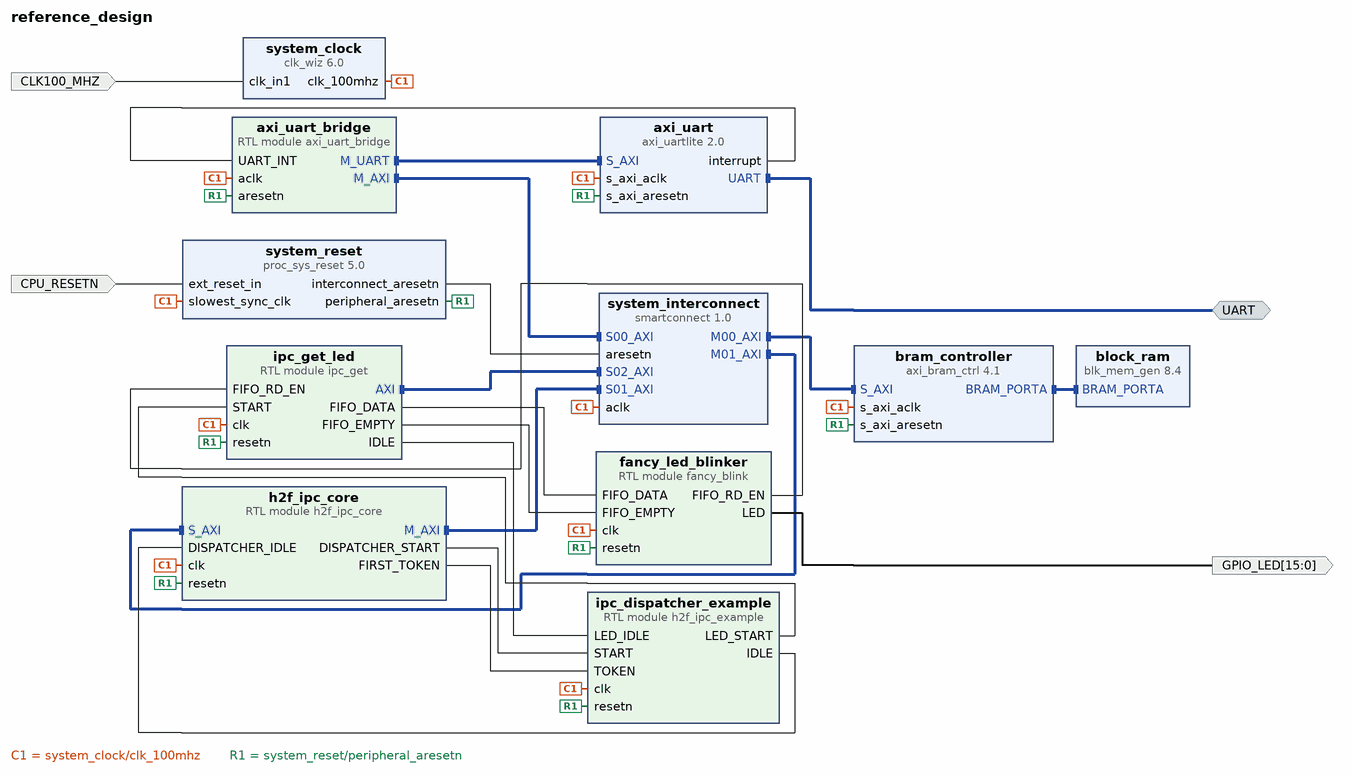
[diagram p0: block diagram of the top level]
# Vivado block design reference_design, xc7a100tcsg324-1, Vivado 2021.1
create_bd_design reference_design

create_bd_intf_port -mode Master -vlnv xilinx.com:interface:uart_rtl:1.0 UART
create_bd_port -dir I -type clk CLK100_MHZ
set_property -dict {CONFIG.ASSOCIATED_RESET CPU_RESETN} [get_bd_ports CLK100_MHZ]
create_bd_port -dir I -type rst CPU_RESETN
create_bd_port -dir O -from 15 -to 0 GPIO_LED

create_bd_cell -type ip -vlnv xilinx.com:ip:clk_wiz:6.0 system_clock
set_property -dict [list \
  CONFIG.CLKOUT1_DRIVES BUFGCE \
  CONFIG.CLKOUT2_DRIVES BUFGCE \
  CONFIG.CLKOUT3_DRIVES BUFGCE \
  CONFIG.CLKOUT4_DRIVES BUFGCE \
  CONFIG.CLKOUT5_DRIVES BUFGCE \
  CONFIG.CLKOUT6_DRIVES BUFGCE \
  CONFIG.CLKOUT7_DRIVES BUFGCE \
  CONFIG.CLK_OUT1_PORT clk_100mhz \
  CONFIG.FEEDBACK_SOURCE FDBK_AUTO \
  CONFIG.USE_LOCKED false \
  CONFIG.USE_RESET false \
  CONFIG.USE_SAFE_CLOCK_STARTUP true \
] [get_bd_cells system_clock]
create_bd_cell -type ip -vlnv xilinx.com:ip:proc_sys_reset:5.0 system_reset
create_bd_cell -type ip -vlnv xilinx.com:ip:smartconnect:1.0 system_interconnect
set_property -dict {CONFIG.NUM_MI 2 CONFIG.NUM_SI 3} [get_bd_cells system_interconnect]
create_bd_cell -type ip -vlnv xilinx.com:ip:axi_bram_ctrl:4.1 bram_controller
set_property -dict {CONFIG.DATA_WIDTH 256 CONFIG.SINGLE_PORT_BRAM 1} [get_bd_cells bram_controller]
create_bd_cell -type ip -vlnv xilinx.com:ip:blk_mem_gen:8.4 block_ram
set_property -dict {CONFIG.EN_SAFETY_CKT false} [get_bd_cells block_ram]
create_bd_cell -type module -reference axi_uart_bridge axi_uart_bridge
create_bd_cell -type ip -vlnv xilinx.com:ip:axi_uartlite:2.0 axi_uart
set_property -dict [list \
  CONFIG.C_BAUDRATE 115200 \
  CONFIG.UARTLITE_BOARD_INTERFACE Custom \
  CONFIG.USE_BOARD_FLOW true \
] [get_bd_cells axi_uart]
create_bd_cell -type module -reference h2f_ipc_example ipc_dispatcher_example
create_bd_cell -type module -reference ipc_get ipc_get_led
create_bd_cell -type module -reference fancy_blink fancy_led_blinker
create_bd_cell -type module -reference h2f_ipc_core h2f_ipc_core

# ---- connections ----

connect_bd_intf_net -intf_net axi_uart_bridge_0_M_AXI [get_bd_intf_pins axi_uart_bridge/M_AXI] [get_bd_intf_pins system_interconnect/S00_AXI]
connect_bd_intf_net -intf_net axi_uart_bridge_0_M_UART [get_bd_intf_pins axi_uart/S_AXI] [get_bd_intf_pins axi_uart_bridge/M_UART]
connect_bd_intf_net -intf_net axi_uartlite_0_UART [get_bd_intf_ports UART] [get_bd_intf_pins axi_uart/UART]
connect_bd_intf_net [get_bd_intf_pins block_ram/BRAM_PORTA] [get_bd_intf_pins bram_controller/BRAM_PORTA]
connect_bd_intf_net -intf_net h2f_ipc_core_0_M_AXI [get_bd_intf_pins h2f_ipc_core/M_AXI] [get_bd_intf_pins system_interconnect/S01_AXI]
connect_bd_intf_net -intf_net ipc_get_0_AXI [get_bd_intf_pins ipc_get_led/AXI] [get_bd_intf_pins system_interconnect/S02_AXI]
connect_bd_intf_net [get_bd_intf_pins bram_controller/S_AXI] [get_bd_intf_pins system_interconnect/M00_AXI]
connect_bd_intf_net [get_bd_intf_pins system_interconnect/M01_AXI] [get_bd_intf_pins h2f_ipc_core/S_AXI]
connect_bd_net -net axi_uartlite_0_interrupt [get_bd_pins axi_uart/interrupt] [get_bd_pins axi_uart_bridge/UART_INT]
connect_bd_net -net clk_in1_0_1 [get_bd_ports CLK100_MHZ] [get_bd_pins system_clock/clk_in1]
connect_bd_net -net clk_wiz_0_clk_100mhz [get_bd_pins system_clock/clk_100mhz] \
  [get_bd_pins system_reset/slowest_sync_clk] [get_bd_pins system_interconnect/aclk] [get_bd_pins bram_controller/s_axi_aclk] \
  [get_bd_pins axi_uart_bridge/aclk] [get_bd_pins axi_uart/s_axi_aclk] [get_bd_pins ipc_dispatcher_example/clk] \
  [get_bd_pins ipc_get_led/clk] [get_bd_pins fancy_led_blinker/clk] [get_bd_pins h2f_ipc_core/clk]
connect_bd_net -net ext_reset_in_0_1 [get_bd_ports CPU_RESETN] [get_bd_pins system_reset/ext_reset_in]
connect_bd_net -net fancy_blink_0_FIFO_RD_EN [get_bd_pins fancy_led_blinker/FIFO_RD_EN] [get_bd_pins ipc_get_led/FIFO_RD_EN]
connect_bd_net -net fancy_blink_0_LED [get_bd_pins fancy_led_blinker/LED] [get_bd_ports GPIO_LED]
connect_bd_net [get_bd_pins h2f_ipc_core/DISPATCHER_START] [get_bd_pins ipc_dispatcher_example/START]
connect_bd_net [get_bd_pins h2f_ipc_core/FIRST_TOKEN] [get_bd_pins ipc_dispatcher_example/TOKEN]
connect_bd_net -net h2f_ipc_example_0_IDLE [get_bd_pins ipc_dispatcher_example/IDLE] [get_bd_pins h2f_ipc_core/DISPATCHER_IDLE]
connect_bd_net -net h2f_ipc_example_LED_START [get_bd_pins ipc_dispatcher_example/LED_START] [get_bd_pins ipc_get_led/START]
connect_bd_net -net ipc_get_0_IDLE [get_bd_pins ipc_get_led/IDLE] [get_bd_pins ipc_dispatcher_example/LED_IDLE]
connect_bd_net [get_bd_pins ipc_get_led/FIFO_DATA] [get_bd_pins fancy_led_blinker/FIFO_DATA]
connect_bd_net [get_bd_pins ipc_get_led/FIFO_EMPTY] [get_bd_pins fancy_led_blinker/FIFO_EMPTY]
connect_bd_net [get_bd_pins system_reset/interconnect_aresetn] [get_bd_pins system_interconnect/aresetn]
connect_bd_net [get_bd_pins system_reset/peripheral_aresetn] \
  [get_bd_pins bram_controller/s_axi_aresetn] [get_bd_pins axi_uart_bridge/aresetn] [get_bd_pins axi_uart/s_axi_aresetn] \
  [get_bd_pins ipc_dispatcher_example/resetn] [get_bd_pins ipc_get_led/resetn] [get_bd_pins fancy_led_blinker/resetn] \
  [get_bd_pins h2f_ipc_core/resetn]

# ---- address map ----
assign_bd_address -offset 0x0000000040040000 -range 64K -target_address_space [get_bd_addr_spaces axi_uart_bridge/M_AXI] [get_bd_addr_segs h2f_ipc_core/S_AXI/reg0]
assign_bd_address -offset 0x00000000C0000000 -range 8K -target_address_space [get_bd_addr_spaces axi_uart_bridge/M_AXI] [get_bd_addr_segs bram_controller/S_AXI/Mem0]
assign_bd_address -offset 0x00000000 -range 64K -target_address_space [get_bd_addr_spaces axi_uart_bridge/M_UART] [get_bd_addr_segs axi_uart/S_AXI/Reg]
assign_bd_address -offset 0x00000000C0000000 -range 8K -target_address_space [get_bd_addr_spaces h2f_ipc_core/M_AXI] [get_bd_addr_segs bram_controller/S_AXI/Mem0]
assign_bd_address -offset 0x0000000100000000 -range 4G -target_address_space [get_bd_addr_spaces h2f_ipc_core/M_AXI] [get_bd_addr_segs h2f_ipc_core/S_AXI/reg0]
assign_bd_address -offset 0x00000000C0000000 -range 8K -target_address_space [get_bd_addr_spaces ipc_get_led/AXI] [get_bd_addr_segs bram_controller/S_AXI/Mem0]
assign_bd_address -offset 0x0000000100000000 -range 4G -target_address_space [get_bd_addr_spaces ipc_get_led/AXI] [get_bd_addr_segs h2f_ipc_core/S_AXI/reg0]

validate_bd_design
save_bd_design
